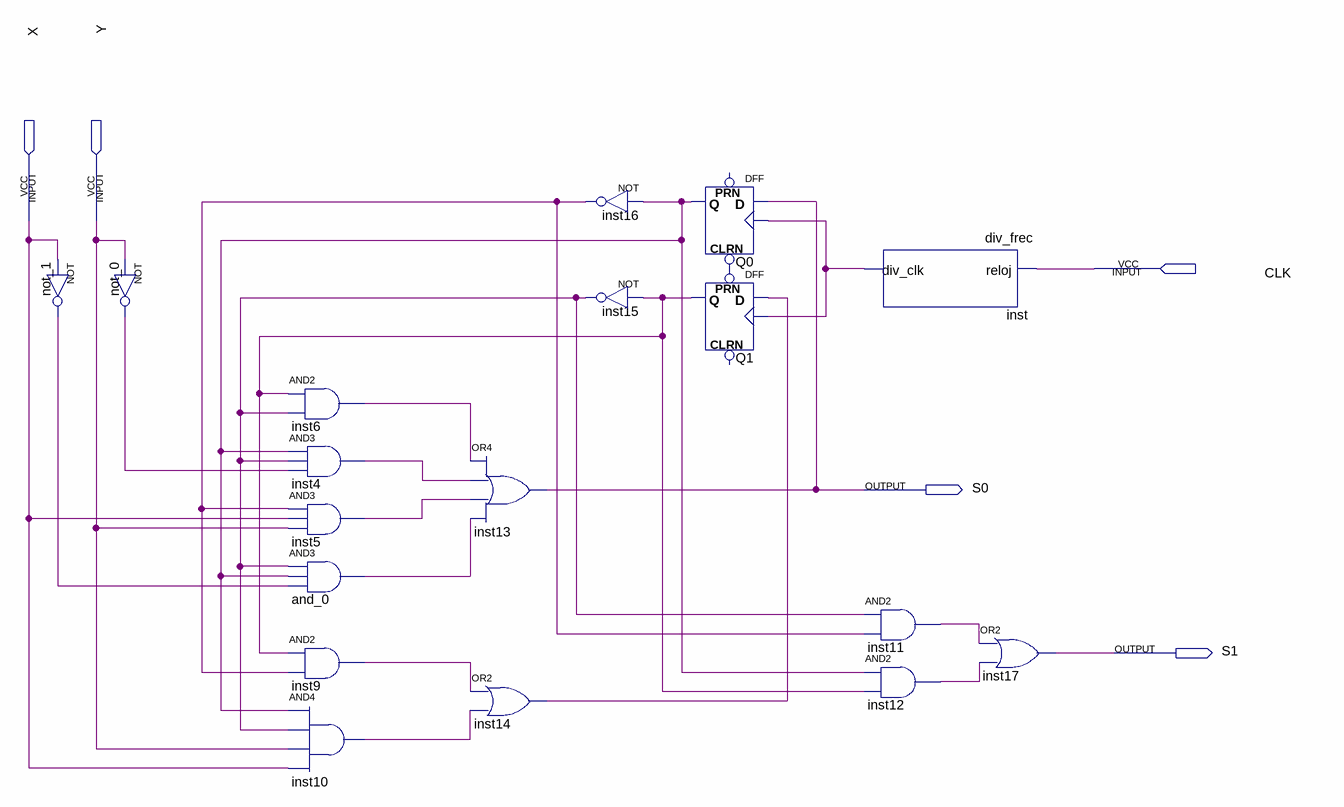
[diagram p0: schematic sheet]
// Quartus schematic practica_2.bdf as structural Verilog: 18 symbols, 5 pins
module practica_2 (
  input  X,
  input  Y,
  input  CLK,
  output S0,
  output S1
);

  wire and_0_out, inst4_out, inst5_out, inst6_out, inst9_out, inst10_out, inst11_out, inst12_out, inst14_out,
       inst15_out, inst16_out, inst_div_clk, not_0_out, not_1_out, Q0_q, Q1_q, undriven;

  not not_1 (not_1_out, X);
  not not_0 (not_0_out, Y);
  and inst6 (inst6_out, Q1_q, inst15_out);
  and inst4 (inst4_out, Q0_q, inst15_out, not_0_out);
  and inst5 (inst5_out, inst16_out, X, Y);
  and and_0 (and_0_out, inst15_out, Q0_q, not_1_out);
  and inst9 (inst9_out, Q1_q, inst16_out);
  and inst10 (inst10_out, Q0_q, inst15_out, Y, X);
  or inst13 (S0, inst6_out, inst4_out, inst5_out, and_0_out);
  or inst14 (inst14_out, inst9_out, inst10_out);
  not inst16 (inst16_out, Q0_q);
  not inst15 (inst15_out, Q1_q);
  DFF Q0 (.CLRN(undriven), .CLK(inst_div_clk), .D(S0), .Q(Q0_q));  // open: PRN
  DFF Q1 (.CLK(inst_div_clk), .D(inst14_out), .PRN(undriven), .Q(Q1_q));  // open: CLRN
  div_frec inst (.reloj(CLK), .div_clk(inst_div_clk));
  and inst11 (inst11_out, inst15_out, inst16_out);
  and inst12 (inst12_out, Q0_q, Q1_q);
  or inst17 (S1, inst11_out, inst12_out);
endmodule
